# EAGLE schematic digit (EAGLE 6.1)
DOC_ID: CLK-SCH-05; DOC_PART_NO: CLK-PC-05; DOC_REV: A; DOC_TITLE: 7 Segment display; PROJECT_NAME: Alarm Clock (Model B)
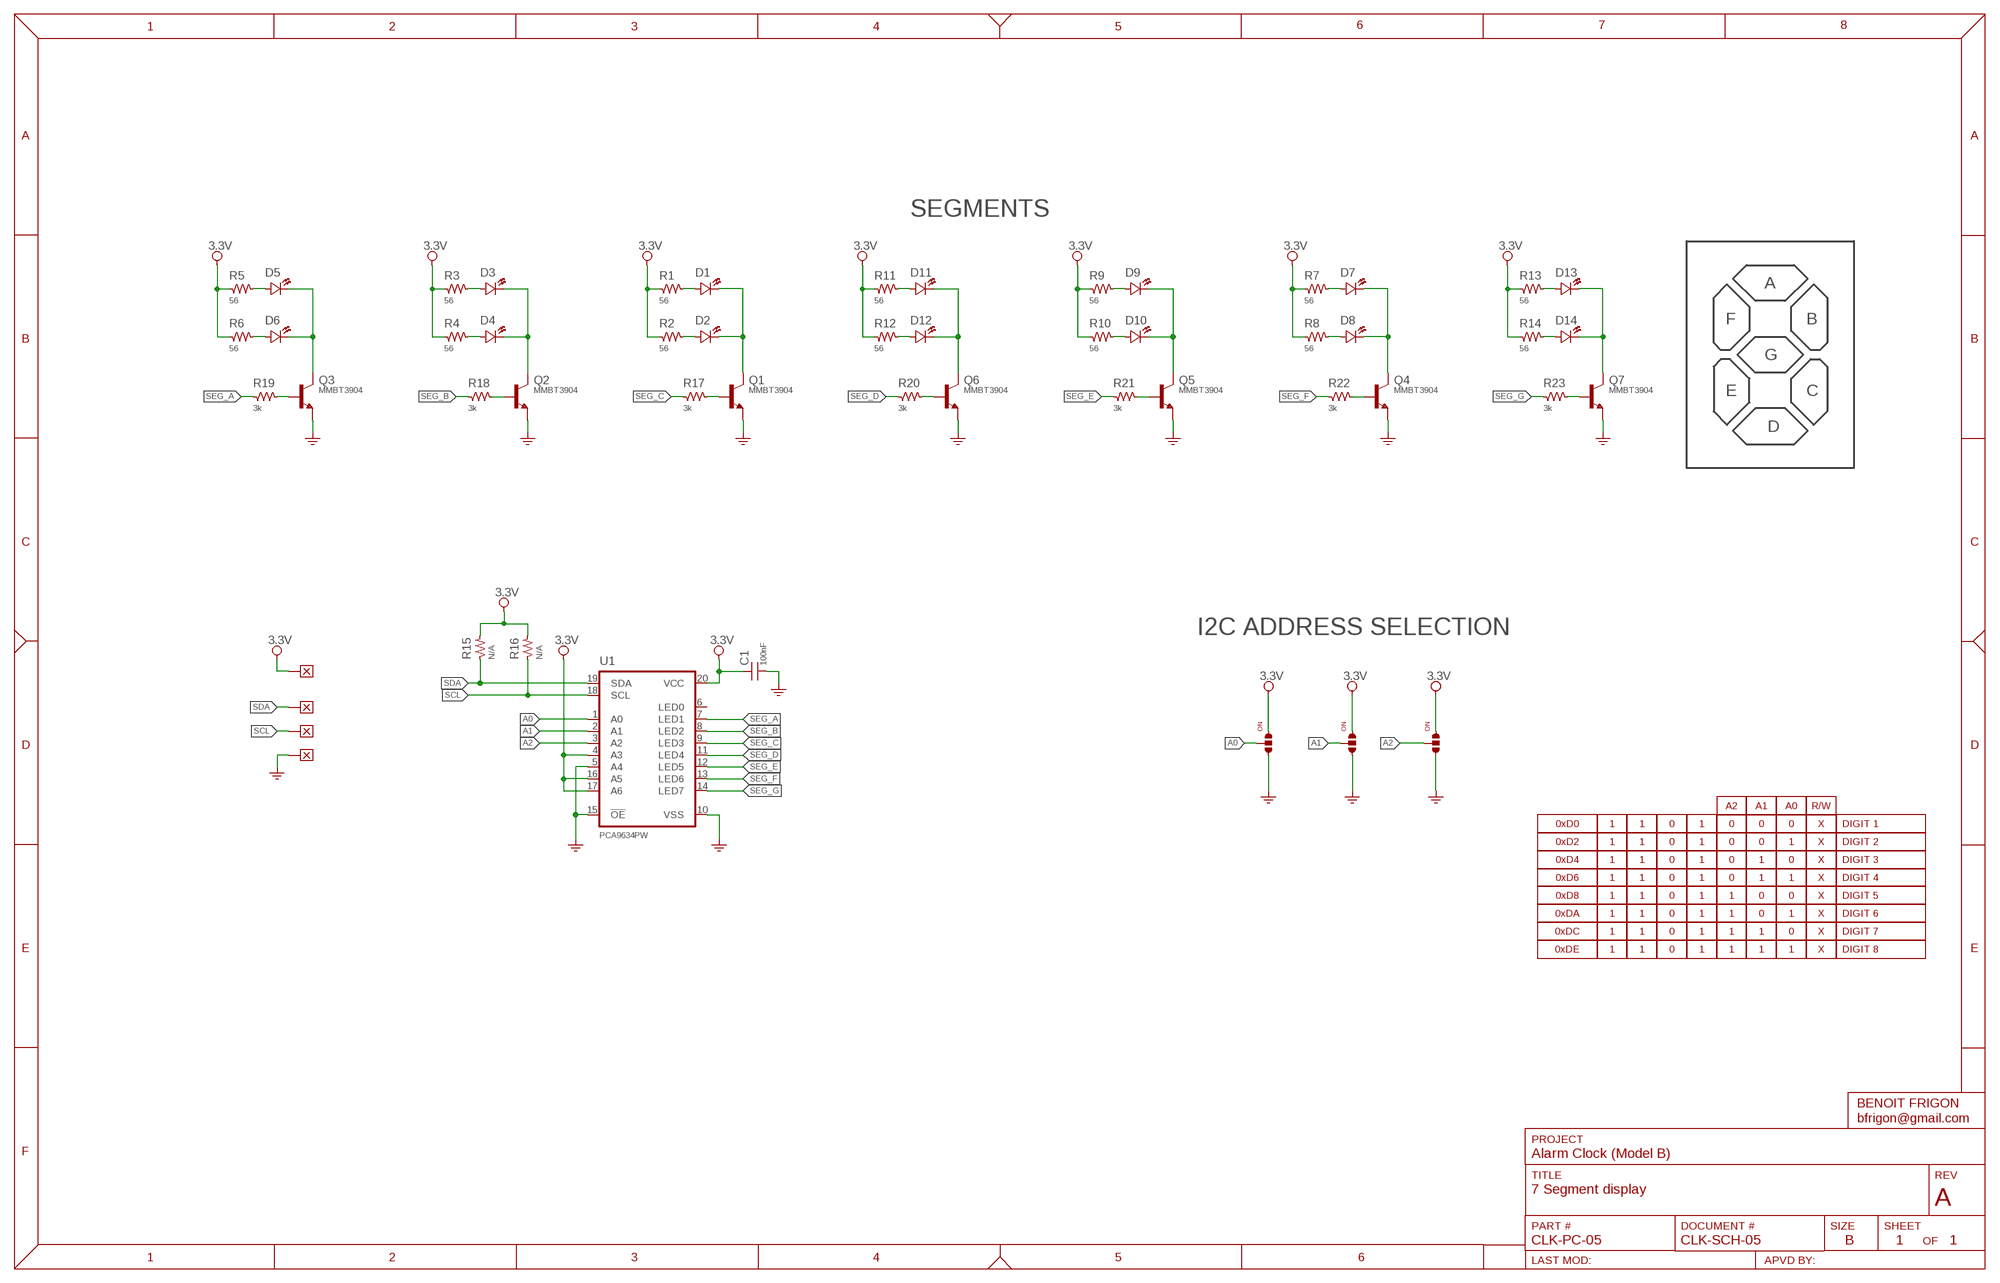
[diagram p0: schematic, sheet 1]

## Parts
C1  100nF  CAP-0603  [SMD_0603]
D1  Red  LED-0805  [CHIPLED_0805]
D2  Red  LED-0805  [CHIPLED_0805]
D3  Red  LED-0805  [CHIPLED_0805]
D4  Red  LED-0805  [CHIPLED_0805]
D5  Red  LED-0805  [CHIPLED_0805]
D6  Red  LED-0805  [CHIPLED_0805]
D7  Red  LED-0805  [CHIPLED_0805]
D8  Red  LED-0805  [CHIPLED_0805]
D9  Red  LED-0805  [CHIPLED_0805]
D10  Red  LED-0805  [CHIPLED_0805]
D11  Red  LED-0805  [CHIPLED_0805]
D12  Red  LED-0805  [CHIPLED_0805]
D13  Red  LED-0805  [CHIPLED_0805]
D14  Red  LED-0805  [CHIPLED_0805]
J1  SOLDER_JUMPER_3  [SOLDER_JUMPER_3]
J2  SOLDER_JUMPER_3  [SOLDER_JUMPER_3]
J3  SOLDER_JUMPER_3  [SOLDER_JUMPER_3]
Q1  MMBT3904  [SOT23]
Q2  MMBT3904  [SOT23]
Q3  MMBT3904  [SOT23]
Q4  MMBT3904  [SOT23]
Q5  MMBT3904  [SOT23]
Q6  MMBT3904  [SOT23]
Q7  MMBT3904  [SOT23]
R1  56  RES-0603  [SMD_0603]
R2  56  RES-0603  [SMD_0603]
R3  56  RES-0603  [SMD_0603]
R4  56  RES-0603  [SMD_0603]
R5  56  RES-0603  [SMD_0603]
R6  56  RES-0603  [SMD_0603]
R7  56  RES-0603  [SMD_0603]
R8  56  RES-0603  [SMD_0603]
R9  56  RES-0603  [SMD_0603]
R10  56  RES-0603  [SMD_0603]
R11  56  RES-0603  [SMD_0603]
R12  56  RES-0603  [SMD_0603]
R13  56  RES-0603  [SMD_0603]
R14  56  RES-0603  [SMD_0603]
R15  N/A  RES-0603  [SMD_0603]
R16  N/A  RES-0603  [SMD_0603]
R17  3k  RES-0603  [SMD_0603]
R18  3k  RES-0603  [SMD_0603]
R19  3k  RES-0603  [SMD_0603]
R20  3k  RES-0603  [SMD_0603]
R21  3k  RES-0603  [SMD_0603]
R22  3k  RES-0603  [SMD_0603]
R23  3k  RES-0603  [SMD_0603]
U1  PCA9634PW  [TSSOP20]
W1  WIRE  [WIRE_SMT]
W2  WIRE  [WIRE_SMT]
W3  WIRE  [WIRE_SMT]
W4  WIRE  [WIRE_SMT]

## Nets
3.3V: C1.1 J1.1 J2.1 J3.1 R1.1 R2.1 R3.1 R4.1 R5.1 R6.1 R7.1 R8.1 R9.1 R10.1 R11.1 R12.1 R13.1 R14.1 R15.2 R16.2 U1.4(A3) U1.16(A5) U1.17(A6) U1.20(VCC) W1.1
A0: J2.2 U1.1(A0)
A1: J1.2 U1.2(A1)
A2: J3.2 U1.3(A2)
GND: C1.2 J1.3 J2.3 J3.3 Q1.2(E) Q2.2(E) Q3.2(E) Q4.2(E) Q5.2(E) Q6.2(E) Q7.2(E) U1.5(A4) U1.10(VSS) U1.15(!OE) W4.1
N$1: Q1.1(B) R17.2
N$2: D7.K D8.K Q4.3(C)
N$3: D13.K D14.K Q7.3(C)
N$4: D1.K D2.K Q1.3(C)
N$5: D3.K D4.K Q2.3(C)
N$6: D5.K D6.K Q3.3(C)
N$7: D3.A R3.2
N$8: D4.A R4.2
N$9: D14.A R14.2
N$10: D13.A R13.2
N$11: D2.A R2.2
N$12: D1.A R1.2
N$13: D5.A R5.2
N$14: D6.A R6.2
N$15: D11.A R11.2
N$16: D9.K D10.K Q5.3(C)
N$17: D11.K D12.K Q6.3(C)
N$18: D12.A R12.2
N$19: D10.A R10.2
N$20: D9.A R9.2
N$21: D7.A R7.2
N$22: D8.A R8.2
N$23: Q2.1(B) R18.2
N$24: Q3.1(B) R19.2
N$25: Q6.1(B) R20.2
N$26: Q5.1(B) R21.2
N$27: Q4.1(B) R22.2
N$28: Q7.1(B) R23.2
SCL: R16.1 U1.18(SCL) W3.1
SDA: R15.1 U1.19(SDA) W2.1
SEG_A: R19.1 U1.7(LED1)
SEG_B: R18.1 U1.8(LED2)
SEG_C: R17.1 U1.9(LED3)
SEG_D: R20.1 U1.11(LED4)
SEG_E: R21.1 U1.12(LED5)
SEG_F: R22.1 U1.13(LED6)
SEG_G: R23.1 U1.14(LED7)
Unconnected: U1.6(LED0)

## Notes on the sheet
- SEGMENTS
- A
- F | B
- G
- E | C
- D
- I2C ADDRESS SELECTION

## Library data of the parts
C1 = Passive:CAP: Capacitor; DESCRIPTION: {DESCRIPTION} - SMT 0603 - {value}; PACKAGE: SMT 0603
D1-D14 = Optoelectronic:LED: Led; COLOR: Red; DESCRIPTION: {DESCRIPTION} Chip 0805 - {ATTR:COLOR}; MFG: Kingbright; PACKAGE: SMT 0805; SKU: APT2012SECK/J3-PRV; VALUE: {ATTR:COLOR}
J1-J3 = Misc:SOLDER_JUMPER_3; BOM: False; SKU: -
Q1-Q7 = Transistor:MMBT3904: NPN Transistor
R1-R23 = Passive:RES: Resistor; DESCRIPTION: {DESCRIPTION} - SMT 0603 - {VALUE}; PACKAGE: SMT 0603
U1 = IC:PCA9634: 8-bit fm+ i2c-bus LED driver The PCA9634 is an I2C-bus controlled 8-bit LED driver optimized for Red/Green/Blue/Amber (RGBA) color mixing applications. Each LED output has its own 8-bit resolution (256 steps) fixed frequency Individual PWM controller that operates at 97 kHz with a duty cycle that is adjustable from 0 % to 99.6 % to allow the LED to be set to a specific brightness value. An additional 8-bit resolution (256 steps) Group PWM controller has both a fixed frequency of 190 Hz and an adjustable frequency between 24 Hz to once every 10.73 seconds with a duty cycle that is adjustable from 0 % to 99.6 % that is used to either dim or blink all LEDs with the same value. Features 8 LED drivers. Each output programmable at: Off On Programmable LED brightness Programmable group dimming/blinking mixed with individual LED brightness 1 MHz Fast-mode Plus compatible I2C-bus interface with 30 mA high drive capability on SDA output for driving high capacitive buses 256-step (8-bit) linear programmable brightness per LED output varying from fully off (default) to maximum brightness using a 97 kHz PWM signal 256-step group brightness control allows general dimming (using a 190 Hz PWM signal) from fully off to maximum brightness (default) 256-step group blinking with frequency programmable from 24 Hz to 10.73 s and duty cycle from 0 % to 99.6 % Eight totem-pole outputs (sink 25 mA and source 10 mA at 5 V) with software programmable open-drain LED outputs selection (default at totem-pole). No input function. Output state change programmable on the Acknowledge or the STOP Command to update outputs byte-by-byte or all at the same time (default to ‘Change on STOP’). Active LOW Output Enable (OE) input pin. LED outputs programmable to 1, 0 or ‘high-impedance’ (default at power-up) when OE is HIGH, thus allowing hardware blinking and dimming of the LEDs. 7 hardware address pins allow 126 devices to be connected to the same I2C-bus 4 software programmable I2C-bus addresses (one LED Group Call address and three LED Sub Call addresses) allow groups of devices to be addressed at the same time in any combination (for example, one register used for ‘All Call’ so that all the PCA9634s on the I2C-bus can be addressed at the same time and the second register used for three different addresses so that 1⁄3 of all devices on the bus can be addressed at the same time in a group). Software enable and disable for I2C-bus address. Software Reset feature (SWRST Call) allows the device to be reset through the I2C-bus 25 MHz internal oscillator requires no external components Internal power-on reset Noise filter on SDA/SCL inputs Edge rate control on outputs No glitch on power-up Supports hot insertion Low standby current Operating power supply voltage range of 2.3 V to 5.5 V 5.5 V tolerant inputs; MFG: NXP Semiconductors
W1-W4 = Misc:WIRE; BOM: False